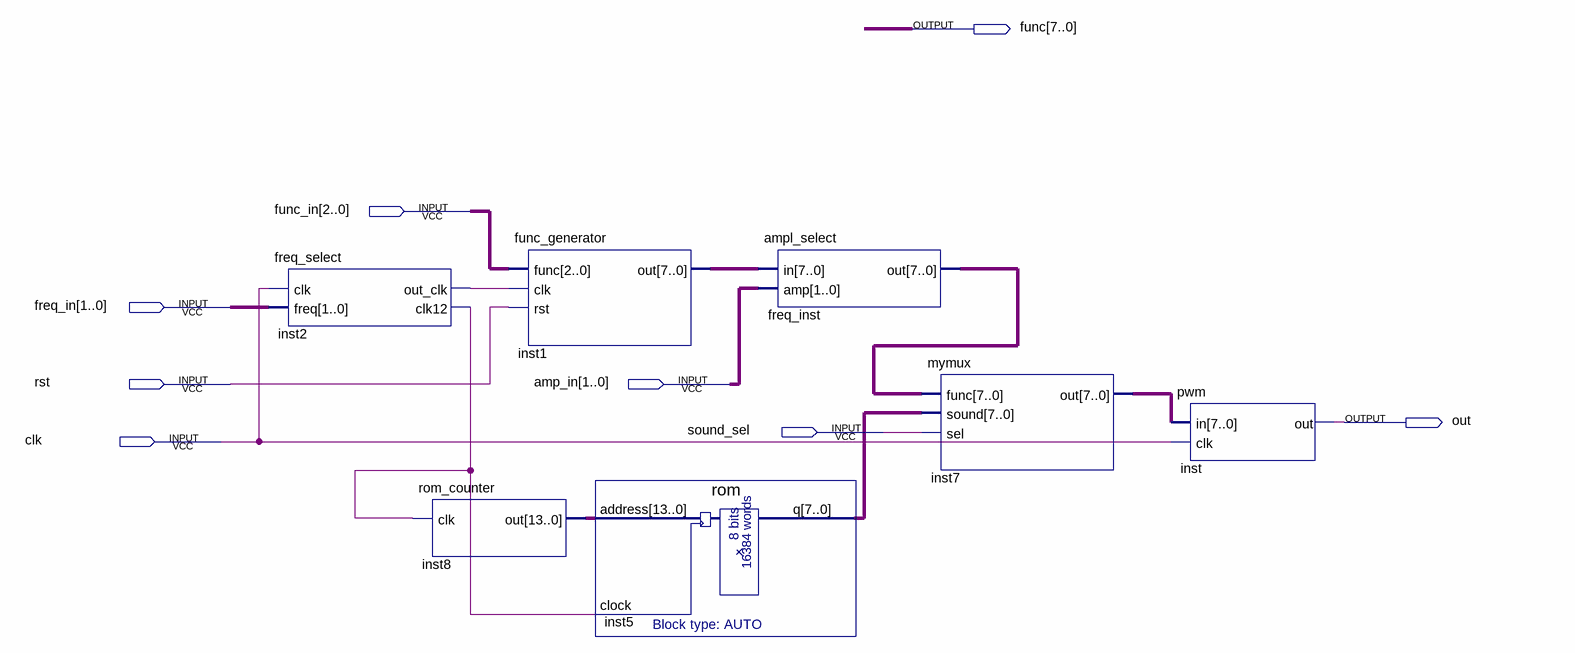
[diagram p0: schematic sheet]
// Quartus schematic dld4.bdf as structural Verilog: 7 symbols, 8 pins
module dld4 (
  input  [2:0] func_in,
  input  [1:0] freq_in,
  input  rst,
  input  [1:0] amp_in,
  input  sound_sel,
  input  clk,
  output [7:0] func,
  output out
);

  wire inst2_clk12, inst2_out_clk;
  wire [7:0] freq_inst_out, inst1_out, inst5_q, inst7_out;
  wire [13:0] inst8_out;

  freq_select inst2 (.clk(clk), .freq(freq_in), .out_clk(inst2_out_clk), .clk12(inst2_clk12));
  rom_counter inst8 (.clk(inst2_clk12), .out(inst8_out));
  func_generator inst1 (.func(func_in), .clk(inst2_out_clk), .rst(rst), .out(inst1_out));
  rom inst5 (.address(inst8_out), .clock(inst2_clk12), .q(inst5_q));
  ampl_select freq_inst (.in(inst1_out), .amp(amp_in), .out(freq_inst_out));
  mymux inst7 (.func(freq_inst_out), .sound(inst5_q), .sel(sound_sel), .out(inst7_out));
  pwm inst (.in(inst7_out), .clk(clk), .out(out));
endmodule
